# Altium schematic sheet DRIVER.SchDoc
size A4
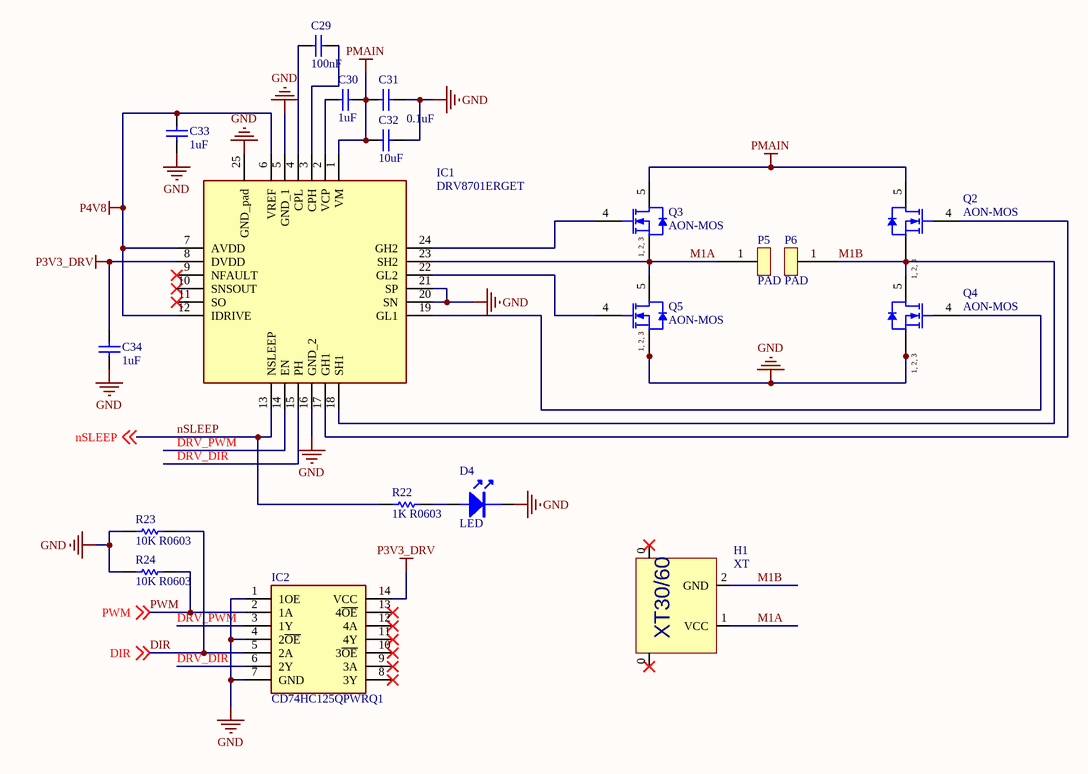
[diagram p0: DRIVER.SchDoc]

## Parts
C29  100nF  [0603_C]
C30  1uF  [0603_C]
C31  0.1uF  [0603_C]
C32  10uF  [0805_c]
C33  1uF  [0603_C]
C34  1uF  [0603_C]
D4  LED  [0603_LED]
H1  XT  [XT30PW-M]
IC1  DRV8701ERGET  [QFN50P400X400X80-25N]
IC2  CD74HC125QPWRQ1  [SOP65P640X120-14N]
P5  PAD  [PAD]
P6  PAD  [PAD]
Q2  AON-MOS  [so-8]
Q3  AON-MOS  [so-8]
Q4  AON-MOS  [so-8]
Q5  AON-MOS  [so-8]
R22  1K R0603  [0603_R]
R23  10K R0603  [0603_R]
R24  10K R0603  [0603_R]

## Nets
GND: C31.2 C32.2 C33.2 C34.2 D4.2(K) IC1.5(GND_1) IC1.16(GND_2) IC1.20(SN) IC1.21(SP) IC1.25(GND_pad) IC2.1(1OE) IC2.4(2~{OE}) IC2.7(GND) Q4.1(S) Q4.2(S) Q4.3(S) Q5.1(S) Q5.2(S) Q5.3(S) R23.1 R24.2
P3V3_DRV: C34.1 IC1.8(DVDD) IC2.14(VCC)
P4V8: C33.1 IC1.6(VREF) IC1.7(AVDD) IC1.12(IDRIVE)
PMAIN: C30.2 C31.1 C32.1 IC1.1(VM) Q2.5(D) Q3.5(D)
DIR: IC2.5(2A) R23.2 ; off-sheet DIR
DRV_DIR: IC1.15(PH) IC2.6(2Y)
DRV_PWM: IC1.14(EN) IC2.3(1Y)
M1A: H1.1(VCC) IC1.23(SH2) P5.1 Q3.1(S) Q3.2(S) Q3.3(S) Q5.5(D)
M1B: H1.2(GND) IC1.18(SH1) P6.1 Q2.1(S) Q2.2(S) Q2.3(S) Q4.5(D)
nSLEEP: IC1.13(NSLEEP) R22.1 ; off-sheet nSLEEP
PWM: IC2.2(1A) R24.1 ; off-sheet PWM
NetC29_1: C29.1 IC1.4(CPL)
NetC29_2: C29.2 IC1.3(CPH)
NetC30_1: C30.1 IC1.2(VCP)
NetD4_1: D4.1(A) R22.2
NetIC1_17: IC1.17(GH1) Q2.4(G)
NetIC1_19: IC1.19(GL1) Q4.4(G)
NetIC1_22: IC1.22(GL2) Q5.4(G)
NetIC1_24: IC1.24(GH2) Q3.4(G)

Not connected (* = marked no-connect by the designer): H1 0(CONN)*; IC1 9(NFAULT)* 10(SNSOUT)* 11(SO)*; IC2 8(3Y)* 9(3A)* 10(3~{OE})* 11(4Y)* 12(4A)* 13(4~{OE})*

## Notes on the sheet
- (in symbol N-MOS-so) 1, 2, 3
- (in symbol XT_Connector_4pin) XT30/60

## Library data of the parts
C29-C34 = CAP: Capacitor; Value: 104; Published: 8-Jun-2000; LatestRevisionDate: 17-Jul-2002; LatestRevisionNote: Re-released for DXP Platform.; PackageReference: RAD-0.3; Publisher: Altium Limited
D4 = LED: LED 发光二极管
H1 = XT_Connector_4pin
IC1 = DRV8701ERGET: Integrated Circuit; Manufacturer_Name: Texas Instruments; Datasheet Link: http://www.ti.com/lit/gpn/drv8701; Height: 1mm; Manufacturer_Part_Number: DRV8701ERGET; Mouser Part Number: 595-DRV8701ERGET; Mouser Price/Stock: https://www.mouser.com/Search/Refine.aspx?Keyword=595-DRV8701ERGET
IC2 = CD74HC125QPWRQ1: Integrated Circuit; Manufacturer_Name: Texas Instruments; Datasheet Link: http://www.ti.com/lit/ds/symlink/cd74hc125-q1.pdf; Height: 1.2mm; Manufacturer_Part_Number: CD74HC125QPWRQ1; Mouser Part Number: 595-CD74HC125QPWRQ1; Mouser Price/Stock: https://www.mouser.com/Search/Refine.aspx?Keyword=595-CD74HC125QPWRQ1
Q2-Q5 = N-MOS-so
R22 = RES: Resistor; Published: 8-Jun-2000; Revision: July-2002: Re-released for DXP Platform.; Publisher: Altium Limited; Value: 1K
R23 R24 = RES: Resistor; Value: 1K; Published: 8-Jun-2000; Revision: July-2002: Re-released for DXP Platform.; Publisher: Altium Limited